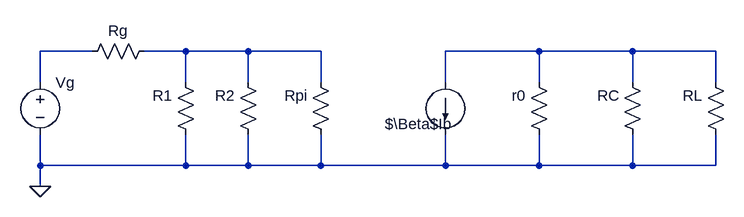
[diagram p0: schematic Try.asc]
Try.asc, the LTspice schematic file:
Version 4
SHEET 1 1172 680
WIRE 80 80 0 80
WIRE 224 80 160 80
WIRE 320 80 224 80
WIRE 432 80 320 80
WIRE 768 80 624 80
WIRE 912 80 768 80
WIRE 1040 80 912 80
WIRE 0 128 0 80
WIRE 224 128 224 80
WIRE 320 128 320 80
WIRE 432 128 432 80
WIRE 624 128 624 80
WIRE 768 128 768 80
WIRE 912 128 912 80
WIRE 1040 128 1040 80
WIRE 0 256 0 208
WIRE 224 256 224 208
WIRE 224 256 0 256
WIRE 320 256 320 208
WIRE 320 256 224 256
WIRE 432 256 432 208
WIRE 432 256 320 256
WIRE 624 256 624 208
WIRE 624 256 432 256
WIRE 768 256 768 208
WIRE 768 256 624 256
WIRE 912 256 912 208
WIRE 912 256 768 256
WIRE 1040 256 1040 208
WIRE 1040 256 912 256
WIRE 0 288 0 256
FLAG 0 288 0
SYMBOL voltage 0 112 R0
WINDOW 3 24 44 Left 2
WINDOW 123 0 0 Left 0
WINDOW 39 0 0 Left 0
SYMATTR Value ""
SYMATTR InstName Vg
SYMBOL res 176 64 R90
WINDOW 0 0 56 VBottom 2
WINDOW 3 -51 -35 VBottom 2
SYMATTR InstName Rg
SYMATTR Value ""
SYMBOL res 240 224 R180
WINDOW 0 36 76 Left 2
WINDOW 3 36 48 Left 2
SYMATTR InstName R1
SYMATTR Value ""
SYMBOL res 336 224 R180
WINDOW 0 36 76 Left 2
WINDOW 3 36 48 Left 2
SYMATTR InstName R2
SYMATTR Value ""
SYMBOL res 448 224 R180
WINDOW 0 36 76 Left 2
WINDOW 3 36 48 Left 2
SYMATTR InstName Rpi
SYMATTR Value ""
SYMBOL res 784 224 R180
WINDOW 0 36 76 Left 2
WINDOW 3 36 48 Left 2
SYMATTR InstName r0
SYMATTR Value ""
SYMBOL res 928 224 R180
WINDOW 0 36 76 Left 2
WINDOW 3 36 48 Left 2
SYMATTR InstName RC
SYMATTR Value ""
SYMBOL res 1056 224 R180
WINDOW 0 36 76 Left 2
WINDOW 3 36 48 Left 2
SYMATTR InstName RL
SYMATTR Value ""
SYMBOL current 624 128 R0
WINDOW 0 -93 64 Left 2
WINDOW 3 -93 92 Left 2
WINDOW 123 0 0 Left 0
WINDOW 39 0 0 Left 0
SYMATTR InstName $\Beta$Ib
SYMATTR Value ""

The netlist it stands for:
* Try.asc
Vg N001 0
Rg N002 N001
R1 0 N002
R2 0 N002
Rpi 0 N002
r0 0 N003
RC 0 N003
RL 0 N003
I§$\Beta$Ib N003 0
.backanno
.end